# Altium schematic sheet 4Z_PCB_2.SchDoc
size A4
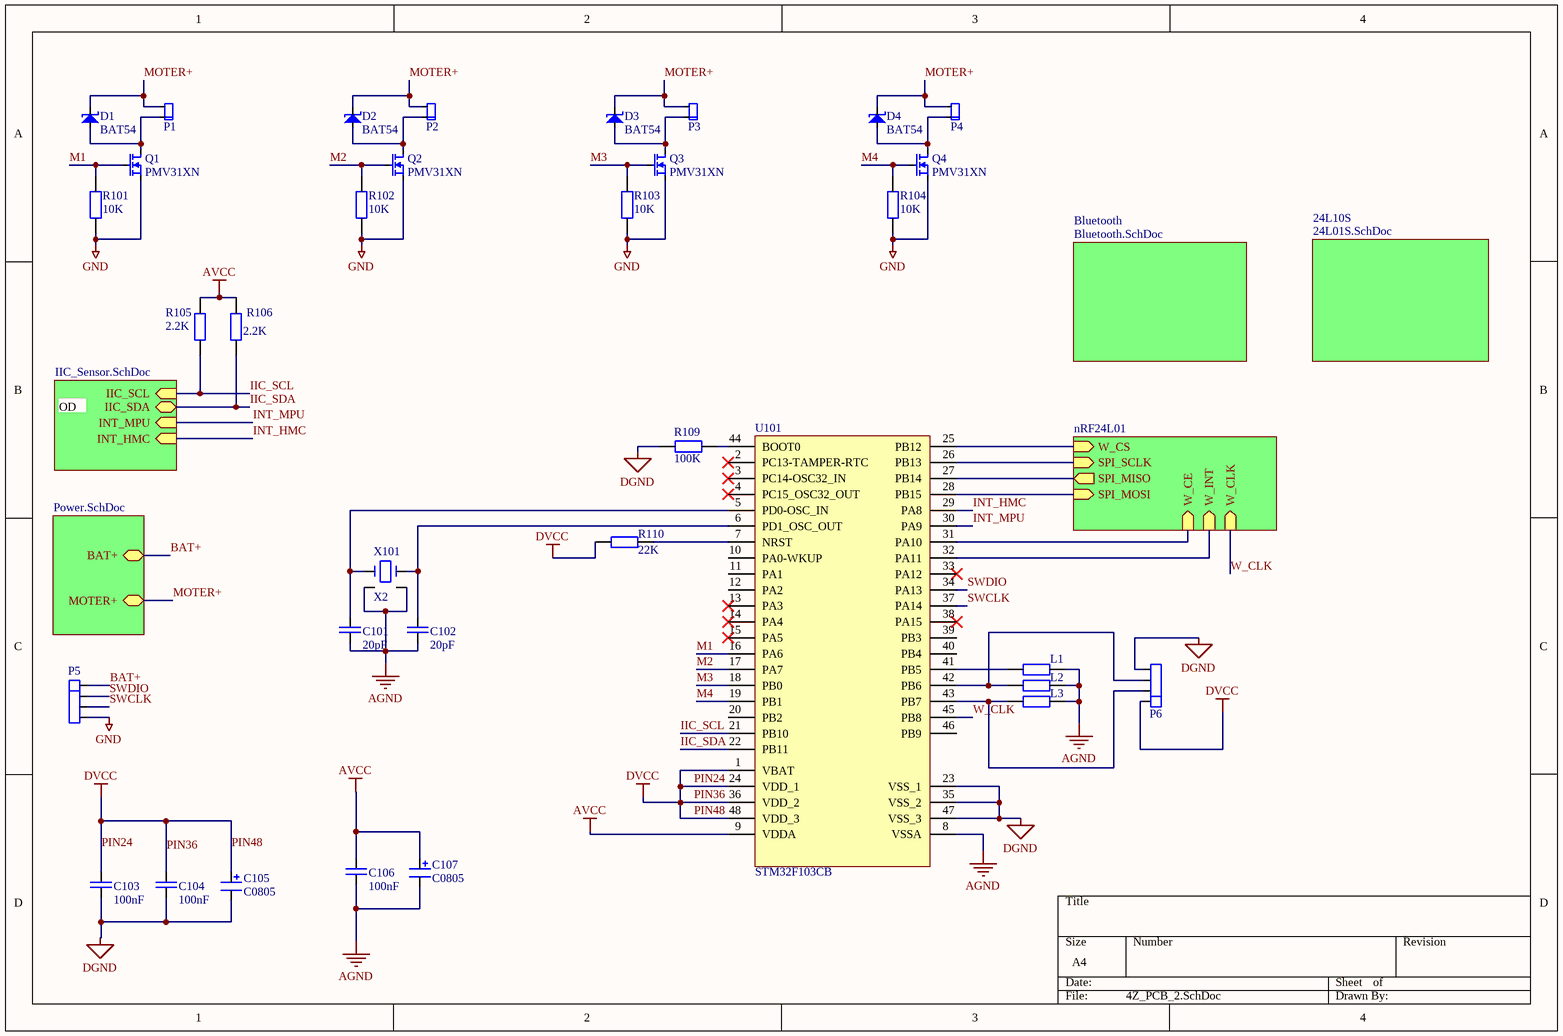
[diagram p0: 4Z_PCB_2.SchDoc]

## Parts
C101  20pF  [0603]
C102  20pF  [0603]
C103  100nF  [0603]
C104  100nF  [0603]
C105  C0805  [0805]
C106  100nF  [0603]
C107  C0805  [0805]
D1  BAT54  [BAT54]
D2  BAT54  [BAT54]
D3  BAT54  [BAT54]
D4  BAT54  [BAT54]
L1  (no value)  [0603]
L2  (no value)  [0603]
L3  (no value)  [0603]
P1  DIP_2  [DIP_2]  (value not drawn)
P2  DIP_2  [DIP_2]  (value not drawn)
P3  DIP_2  [DIP_2]  (value not drawn)
P4  DIP_2  [DIP_2]  (value not drawn)
P5  DIP_4  [DIP_4]  (value not drawn)
P6  (no value)  [DIP_4]
Q1  PMV31XN  [SOT23-TO236AB]
Q2  PMV31XN  [SOT23-TO236AB]
Q3  PMV31XN  [SOT23-TO236AB]
Q4  PMV31XN  [SOT23-TO236AB]
R101  10K  [0603]
R102  10K  [0603]
R103  10K  [0603]
R104  10K  [0603]
R105  2.2K  [0603]
R106  2.2K  [0603]
R109  100K  [0603]
R110  22K  [0603]
U101  STM32F103CB  [LQFP48]
X101  X2  [3225]

## Sub-sheets
24L10S = 24L01S.SchDoc: no entries
Bluetooth = Bluetooth.SchDoc: no entries
IIC_Sensor = IIC_Sensor.SchDoc: IIC_SCL (in), IIC_SDA (bidir), INT_MPU (in), INT_HMC (in)
nRF24L01 = nRF24L01: W_CE (in), W_CS (in), W_CLK (in), SPI_SCLK (in), SPI_MOSI (in), SPI_MISO (out), W_INT (in)
Power = Power.SchDoc: BAT+, MOTER+

## Nets
AGND: C101.1 C102.1 C106.1 C107.2 L1.1 L2.1 L3.1 U101.8(VSSA) X101.2 X101.4
AVCC: C106.2 C107.1 R105.1 R106.1 U101.9(VDDA)
DGND: C103.1 C104.1 C105.2 P6.4 R109.2 U101.23(VSS_1) U101.35(VSS_2) U101.47(VSS_3)
GND: P5.4 Q1.2 Q2.2 Q3.2 Q4.2 R101.2 R102.2 R103.2 R104.2
PIN24: C103.2 C104.2 C105.1 P6.1 R110.2 U101.1(VBAT) U101.24(VDD_1) U101.36(VDD_2) U101.48(VDD_3)  [also labelled DVCC, PIN36, PIN48]
BAT+: P5.1 ; sheet Power/BAT+
IIC_SCL: R105.2 U101.21(PB10) ; sheet IIC_Sensor/IIC_SCL
IIC_SDA: R106.2 U101.22(PB11) ; sheet IIC_Sensor/IIC_SDA
INT_HMC: U101.29(PA8) ; sheet IIC_Sensor/INT_HMC
INT_MPU: U101.30(PA9) ; sheet IIC_Sensor/INT_MPU
M1: Q1.1 R101.1 U101.16(PA6)
M2: Q2.1 R102.1 U101.17(PA7)
M3: Q3.1 R103.1 U101.18(PB0)
M4: Q4.1 R104.1 U101.19(PB1)
MOTER+: D1.3 D2.3 D3.3 D4.3 P1.2 P2.2 P3.2 P4.2 ; sheet Power/MOTER+
SWCLK: P5.3 U101.37(PA14)
SWDIO: P5.2 U101.34(PA13)
W_CLK: U101.45(PB8) ; sheet nRF24L01/W_CLK
NetC101_2: C101.2 U101.5(PD0-OSC_IN) X101.1
NetC102_2: C102.2 U101.6(PD1_OSC_OUT) X101.3
NetD1_1: D1.1 P1.1 Q1.3
NetD2_1: D2.1 P2.1 Q2.3
NetD3_1: D3.1 P3.1 Q3.3
NetD4_1: D4.1 P4.1 Q4.3
NetL1_2: L1.2 U101.41(PB5)
NetL2_2: L2.2 P6.3 U101.42(PB6)
NetL3_2: L3.2 P6.2 U101.43(PB7)
NetR109_1: R109.1 U101.44(BOOT0)
NetR110_1: R110.1 U101.7(NRST)
NetU101_25: U101.25(PB12) ; sheet nRF24L01/W_CS
NetU101_26: U101.26(PB13) ; sheet nRF24L01/SPI_SCLK
NetU101_27: U101.27(PB14) ; sheet nRF24L01/SPI_MISO
NetU101_28: U101.28(PB15) ; sheet nRF24L01/SPI_MOSI
NetU101_31: U101.31(PA10) ; sheet nRF24L01/W_CE
NetU101_32: U101.32(PA11) ; sheet nRF24L01/W_INT

Not connected (* = marked no-connect by the designer): U101 2(PC13-TAMPER-RTC)* 3(PC14-OSC32_IN)* 4(PC15_OSC32_OUT)* 10(PA0-WKUP) 11(PA1) 12(PA2) 13(PA3)* 14(PA4)* 15(PA5)* 20(PB2) 33(PA12)* 38(PA15)* 39(PB3) 40(PB4) 46(PB9)

## Notes on the sheet
- OD

## Library data of the parts
C101-C104 C106 = C0603
L1-L3 R101-R106 R109 R110 = R0603
P6 = DIP_4
X101 = X2: 3225